# Altium schematic sheet power_POS5V_POS3V3_CTL.schdoc: POS5V.schdoc
size A4; Organization: Badgerloop; Address1: 133 Engineering Research; Address2: Building; Address3: Madison, WI 53715; DocumentNumber: 1; Revision: A; SheetNumber: 1; SheetTotal: 2
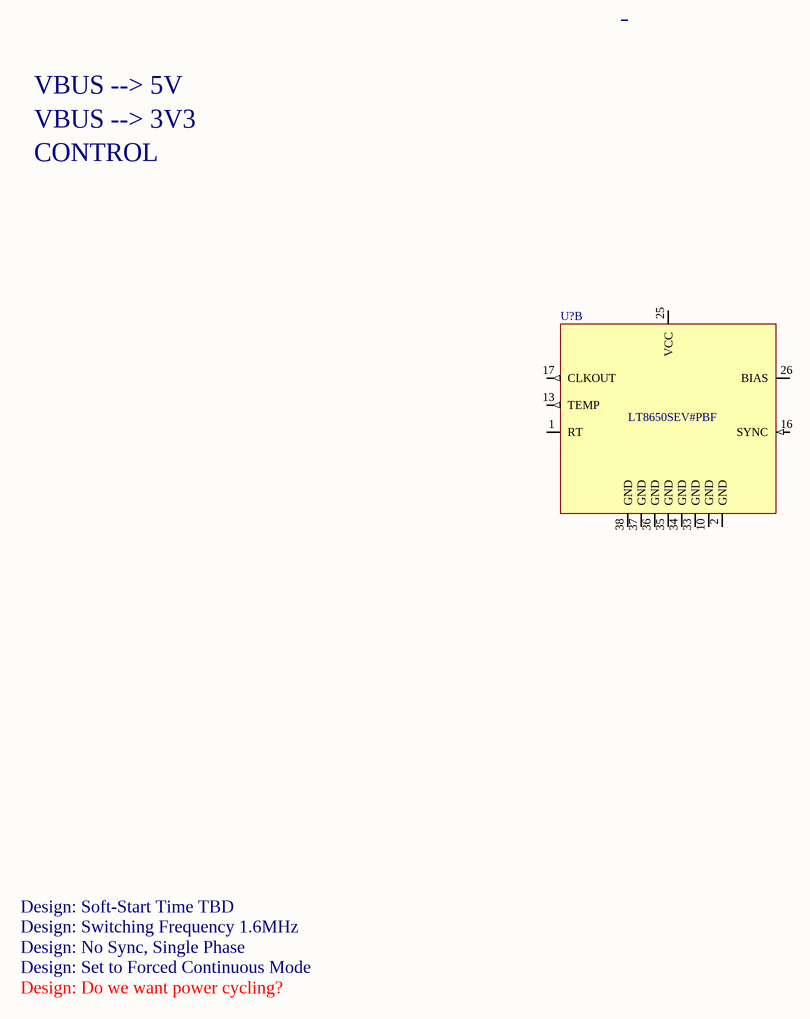
[diagram p0: power_POS5V_POS3V3_CTL.schdoc]

## Parts
U?  LT8650SEV#PBF  [QFN50P600X400X103-32N240X440]  (part B of 2)

## Nets

Not connected (* = marked no-connect by the designer): U? 1(RT) 2(GND) 10(GND) 13(TEMP) 16(SYNC) 17(CLKOUT) 25(VCC) 26(BIAS) 33(GND) 34(GND) 35(GND) 36(GND) 37(GND) 38(GND)

## Notes on the sheet
- VBUS --> 5V
- VBUS --> 3V3
- CONTROL
- Design: Soft-Start Time TBD
- Design: Switching Frequency 1.6MHz
- Design: No Sync, Single Phase
- Design: Set to Forced Continuous Mode
- Design: Do we want power cycling?
- Title
- Size:
- Date:
- A4
- Number:
- Time:
- Revision:
- Sheet
- of
- File:

## Library data of the parts
U? = LT8650SEV#PBF: LT8650S - Dual Channel 4A, 42V, Synchronous Step-Down Silent Switcher 2 with 6.2ÂµA Quiescent Current; MF: Linear Technology; MP: LT8650SEV#PBF; SnapEDA_Link: https://www.snapeda.com/parts/LT8650SEV%23PBF/Linear%20Technology/Analog%20Devices/view-part/?ref=snap; Digi-Key_Part_Number: LT8650SEV#PBF-ND; Package: LQFN-32 Linear Technology; Digi-Key_Purchase_URL: https://www.digikey.com/product-detail/en/linear-technology-analog-devices/LT8650SEV-PBF/LT8650SEV-PBF-ND/7702365?utm_source=snapeda&utm_medium=aggregator&utm_campaign=symbol; Value: *